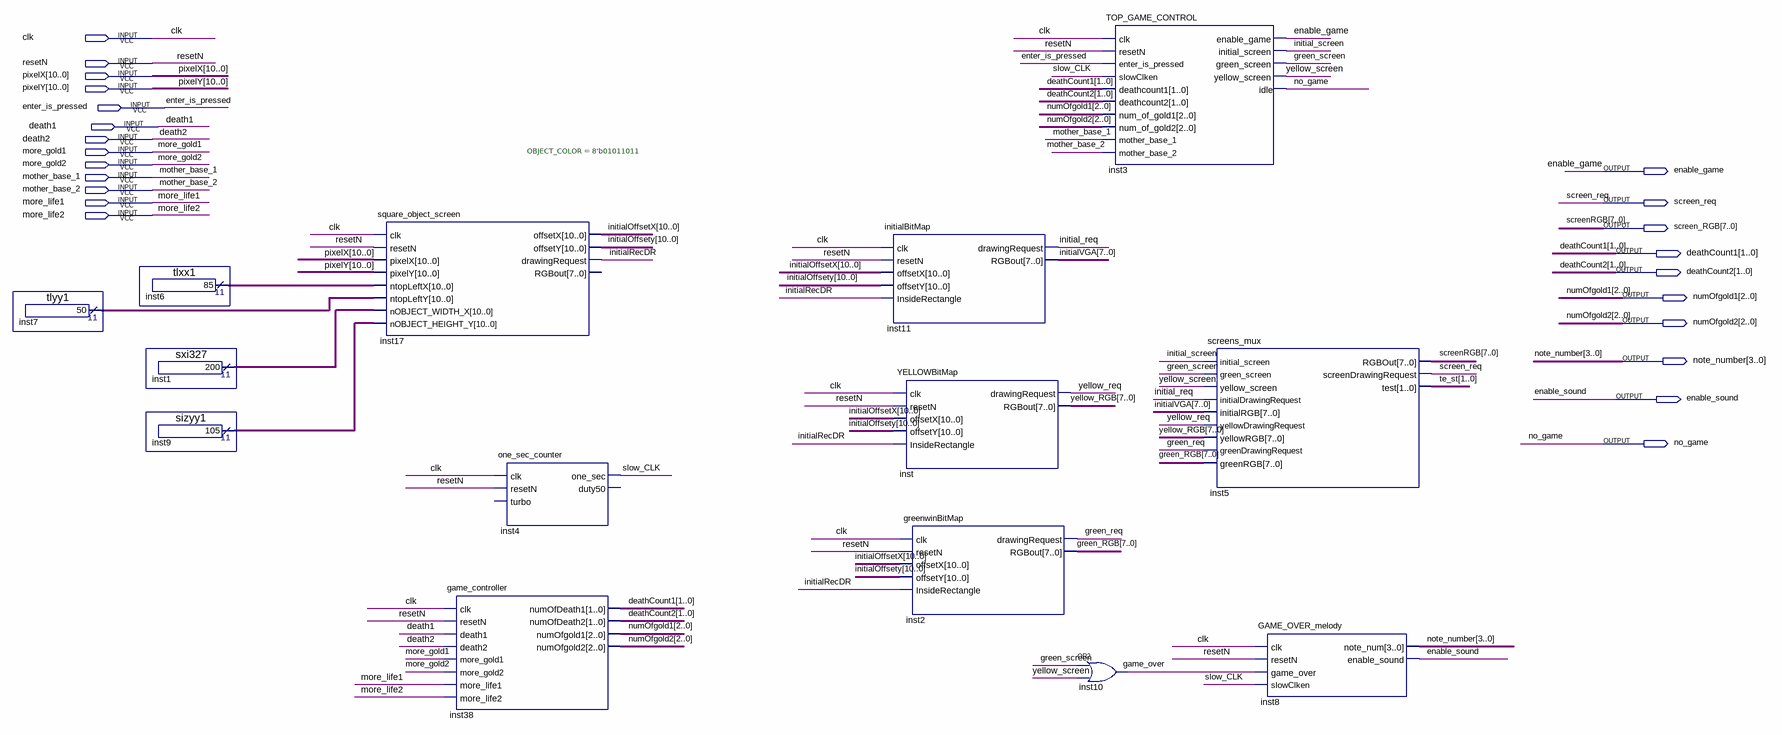
[diagram p0: schematic sheet]
// Quartus schematic screens.bdf as structural Verilog: 14 symbols, 23 pins
module screens (
  input  clk,
  input  resetN,
  input  [10:0] pixelX,
  input  [10:0] pixelY,
  input  enter_is_pressed,
  input  death1,
  input  death2,
  input  more_gold1,
  input  more_gold2,
  input  mother_base_1,
  input  mother_base_2,
  input  more_life1,
  input  more_life2,
  output enable_game,
  output screen_req,
  output [7:0] screen_RGB,
  output [1:0] deathCount1,
  output [1:0] deathCount2,
  output [2:0] numOfgold1,
  output [2:0] numOfgold2,
  output [3:0] note_number,
  output enable_sound,
  output no_game
);

  wire game_over, green_req, green_screen, initial_req, initial_screen, initialRecDR, slow_CLK, yellow_req,
       yellow_screen;
  wire [1:0] te_st;
  wire [7:0] green_RGB, initialVGA, yellow_RGB;
  wire [10:0] initialOffsetX, initialOffsety, inst1_result, inst6_result, inst7_result, inst9_result;

  tlyy1 inst7 (.result(inst7_result));
  tlxx1 inst6 (.result(inst6_result));
  sxi327 inst1 (.result(inst1_result));
  sizyy1 inst9 (.result(inst9_result));
  square_object_screen #(.OBJECT_COLOR(8'b01011011)) inst17 (
    .clk(clk), .resetN(resetN), .pixelX(pixelX), .pixelY(pixelY), .ntopLeftX(inst6_result),
    .ntopLeftY(inst7_result), .nOBJECT_WIDTH_X(inst1_result), .nOBJECT_HEIGHT_Y(inst9_result),
    .offsetX(initialOffsetX), .offsetY(initialOffsety), .drawingRequest(initialRecDR));  // open: RGBout
  game_controller inst38 (
    .clk(clk), .resetN(resetN), .death1(death1), .death2(death2), .more_gold1(more_gold1),
    .more_gold2(more_gold2), .more_life1(more_life1), .more_life2(more_life2), .numOfDeath1(deathCount1),
    .numOfDeath2(deathCount2), .numOfgold1(numOfgold1), .numOfgold2(numOfgold2));
  one_sec_counter inst4 (.clk(clk), .resetN(resetN), .one_sec(slow_CLK));  // open: turbo, duty50
  initialBitMap inst11 (
    .clk(clk), .resetN(resetN), .offsetX(initialOffsetX), .offsetY(initialOffsety),
    .InsideRectangle(initialRecDR), .drawingRequest(initial_req), .RGBout(initialVGA));
  YELLOWBitMap inst (
    .clk(clk), .resetN(resetN), .offsetX(initialOffsetX), .offsetY(initialOffsety),
    .InsideRectangle(initialRecDR), .drawingRequest(yellow_req), .RGBout(yellow_RGB));
  greenwinBitMap inst2 (
    .clk(clk), .resetN(resetN), .offsetX(initialOffsetX), .offsetY(initialOffsety),
    .InsideRectangle(initialRecDR), .drawingRequest(green_req), .RGBout(green_RGB));
  or inst10 (game_over, green_screen, yellow_screen);
  TOP_GAME_CONTROL inst3 (
    .clk(clk), .resetN(resetN), .enter_is_pressed(enter_is_pressed), .slowClken(slow_CLK),
    .deathcount1(deathCount1), .deathcount2(deathCount2), .num_of_gold1(numOfgold1),
    .num_of_gold2(numOfgold2), .mother_base_1(mother_base_1), .mother_base_2(mother_base_2),
    .enable_game(enable_game), .initial_screen(initial_screen), .green_screen(green_screen),
    .yellow_screen(yellow_screen), .idle(no_game));
  screens_mux inst5 (
    .initial_screen(initial_screen), .green_screen(green_screen), .yellow_screen(yellow_screen),
    .initialDrawingRequest(initial_req), .initialRGB(initialVGA), .yellowDrawingRequest(yellow_req),
    .yellowRGB(yellow_RGB), .greenDrawingRequest(green_req), .greenRGB(green_RGB), .RGBOut(screen_RGB),
    .screenDrawingRequest(screen_req), .test(te_st));
  GAME_OVER_melody inst8 (
    .clk(clk), .resetN(resetN), .game_over(game_over), .slowClken(slow_CLK), .note_num(note_number),
    .enable_sound(enable_sound));

  // Other names for the same wires on the sheet: screenRGB[7:0] = screen_RGB
endmodule
